# EAGLE design RADIO (EAGLE 9.4.2)
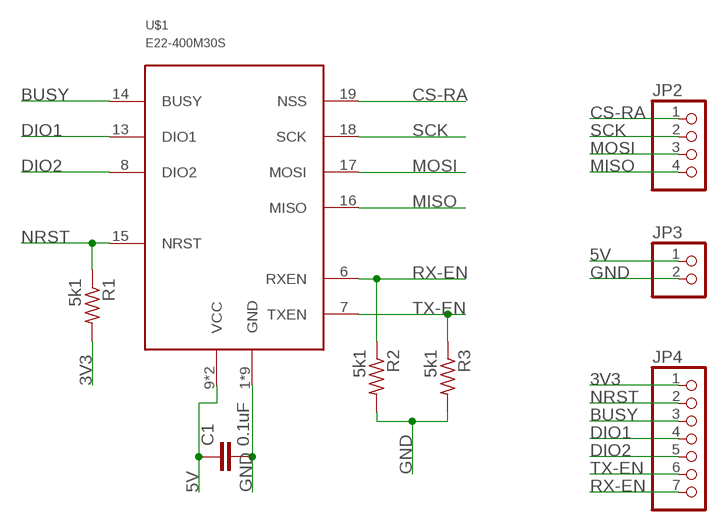
[diagram p0: schematic, sheet 1]

## Parts
C1  0.1uF  C-EUC0603  [C0603]
JP2  PINHD-1X4  [1X04]
JP3  PINHD-1X2  [1X02]
JP4  PINHD-1X7  [1X07]
R1  5k1  R-US_R0603  [R0603]
R2  5k1  R-US_R0603  [R0603]
R3  5k1  R-US_R0603  [R0603]
U$1  E22-400M30S  [E22-400M30S]

## Nets
3V3: JP4.1 R1.2
5V: C1.1 JP3.1 U$1.9(VCC) U$1.10(VCC)
BUSY: JP4.3 U$1.14(BUSY)
CS-RA: JP2.1 U$1.19(NSS)
DIO1: JP4.4 U$1.13(DIO1)
DIO2: JP4.5 U$1.8(DIO2)
GND: C1.2 JP3.2 R2.2 R3.2 U$1.1(GND) U$1.2(GND) U$1.3(GND) U$1.4(GND) U$1.5(GND) U$1.11(GND) U$1.12(GND) U$1.20(GND) U$1.22(GND)
MISO: JP2.4 U$1.16(MISO)
MOSI: JP2.3 U$1.17(MOSI)
NRST: JP4.2 R1.1 U$1.15(NRST)
RX-EN: JP4.7 R2.1 U$1.6(RXEN)
SCK: JP2.2 U$1.18(SCK)
TX-EN: JP4.6 R3.1 U$1.7(TXEN)

## Library data of the parts
C1 = rcl:C-EU: CAPACITOR, European symbol; SPICEPREFIX: C
JP2 = pinhead:PINHD-1X4: PIN HEADER
JP3 = pinhead:PINHD-1X2: PIN HEADER
JP4 = pinhead:PINHD-1X7: PIN HEADER
R1-R3 = resistor:R-US_: RESISTOR, American symbol
U$1 = CanCubeSat:E22-400M30S: EBYTE E22400M30S radio module Datasheet and info: http://www.ebyte.com/en/product-view-news.aspx?id=454

## Board
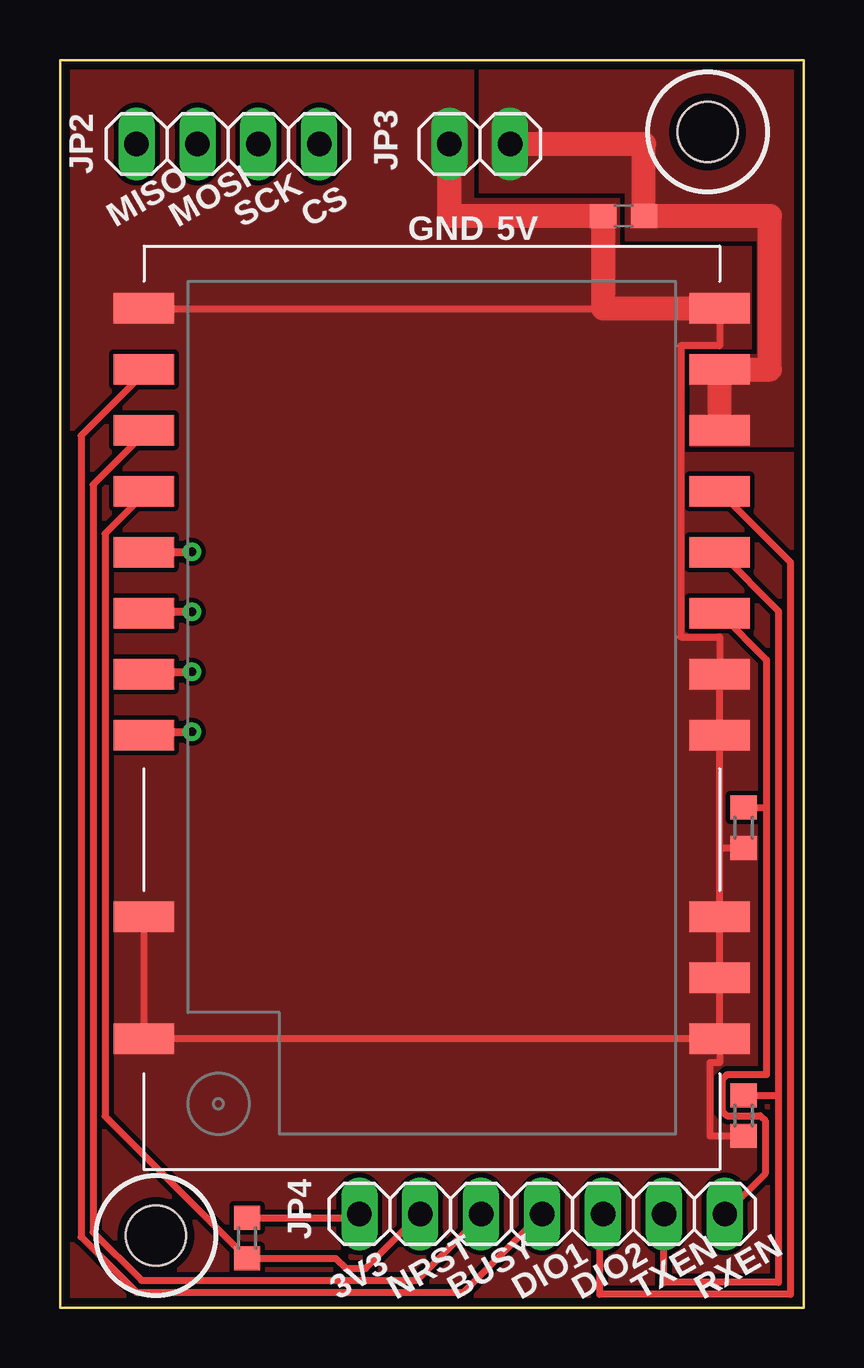
[diagram p1: board, top side]
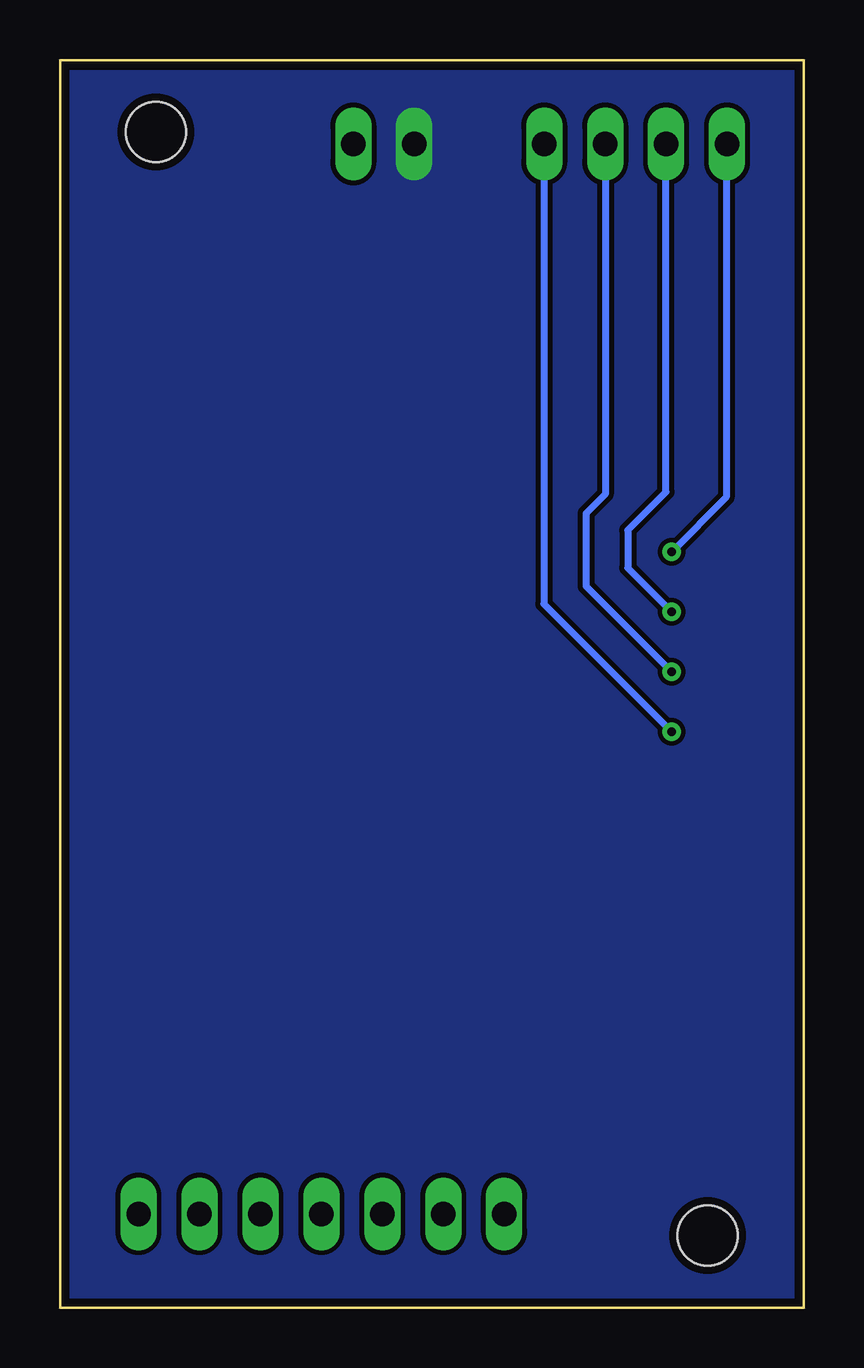
[diagram p2: board, bottom side, seen from below]

Size 31 x 52 mm. Coordinates in mm from the lower left corner, seen from the top.
Outline: 31,0 0,0 0,52 31,52 31,0
Copper layers (1*16): Top 0.035mm / dielectric 1.5mm / Bottom 0.035mm
Design rules "default *": minimum track width 0.3mm, minimum drill 0.35mm, track to track 0.2mm, track to pad 0.2mm, pad to pad 0.2mm, via to via 0.2mm, smd to smd 0.2mm, copper to edge 0.35mm, drill to drill 0.2mm, minimum pad ring 10mil, minimum via ring 8mil, stop-mask expansion 2mil, vias tented up to drill 0mil, thermal gap 10mil
Holes 2.5 mm at 4,3 27,49

### Footprints (pad centres in the part's own frame; a part is rotated, then mirrored left to right if it is on the bottom)
C0603 = smd 1.1 x 1: 1 -0.85,0; 2 0.85,0
1X04 = drill 1.016 long: 1 -3.81,0; 2 -1.27,0; 3 1.27,0; 4 3.81,0
1X02 = drill 1.016 long: 1 -1.27,0; 2 1.27,0
1X07 = drill 1.016 long: 1 -7.62,0; 2 -5.08,0; 3 -2.54,0; 4 0,0; 5 2.54,0; 6 5.08,0; 7 7.62,0
R0603 = smd 1 x 1.1: 1 -0.85,0; 2 0.85,0
E22-400M30S = smd 2.54 x 1.27: 1 12,-13.79; 2 12,-11.25; 3 12,-8.71; 4 12,-1.14; 5 12,1.4; 6 12,3.94; 7 12,6.48; 8 12,9.02; 9 12,11.56; 10 12,14.1; 11 12,16.64; 12 -12,16.64; 13 -12,14.1; 14 -12,11.56; 15 -12,9.02; 16 -12,6.48; 17 -12,3.94; 18 -12,1.4; 19 -12,-1.14; 20 -12,-8.71; 22 -12,-13.79

### Placement (x,y rotation side)
C1  23.5,45.5 180 top
JP2  7,48.5 180 top
JP3  17.5,48.5 180 top
JP4  20.1,3.9 0 top
R1  7.8,2.9 90 top
R2  28.5,20 270 top
R3  28.5,8 270 top
U$1  15.5,25 0 top

### Tracks (layer width: path | path; a pad name or v marks a point on that pad's centre or on a via)
3V3
  Top 0.3: R1.2 12.33,3.75 JP4.1
5V
  Top 1: U$1.9 U$1.10 29.6,39.1 29.6,45.5 C1.1 24.35,48.5 JP3.1
  pour Top (no thermals): 17.5,52 31,52 31,35.9 26.3,35.9 26.3,39.7 29.1,39.7 29.1,44.5 23.6,44.5 23.6,46.5 17.5,46.5
BUSY
  Top 0.3: U$1.14 3.5,36.42 1.38,34.3 1.38,3.15 3.4,1.13 14.88,1.13 17.56,3.81 JP4.3
CS-RA  (via drill 0.35)
  Top 0.34: U$1.19 3.64,24 v5.5,24
  Bottom 0.3: v5.5,24 10.83,29.33 10.83,48.48 JP2.1
DIO1
  Top 0.3: U$1.13 3.5,38.96 0.88,36.34 0.88,2.94 3.19,0.63 16.83,0.63 JP4.4
DIO2
  Top 0.3: U$1.8 30.45,31.07 30.45,0.55 22.5,0.55 22.5,3.76 JP4.5
GND
  Top 0.3: 27.5,11.5 U$1.1 27.5,10.2 27.1,10.2 27.1,7.15 R3.2 | 27.5,11.5 U$1.2 U$1.3 27.5,19.15 | 27.5,19.15 R2.2 | 27.5,19.15 U$1.4 U$1.5 27.5,27.95 25.88,27.95 25.88,40.09 27.5,40.09 U$1.11 U$1.12 | U$1.20 U$1.22 27.21,11.21 27.5,11.5
  Top 1: JP3.2 16.23,45.5 C1.2 22.65,41.64 U$1.11
  pour Top (rank 2, no thermals): 0,0 0,52 31,52 31,0
  pour Bottom (no thermals): 0,0 0,52 31,52 31,0
MISO  (via drill 0.35)
  Top 0.34: U$1.16 3.52,31.5 v5.5,31.5
  Bottom 0.3: JP2.4 3.23,48.46 3.23,33.77 v5.5,31.5
MOSI  (via drill 0.35)
  Top 0.34: v5.5,29 3.56,29 U$1.17
  Bottom 0.3: v5.5,29 7.33,30.83 7.33,32.4 5.73,34 JP2.3
NRST
  Top 0.3: U$1.15 3.5,33.88 1.88,32.26 1.88,7.97 R1.1 11.49,2.05 11.92,1.63 12.75,1.63 JP4.2
RX-EN
  Top 0.3: U$1.6 29.45,26.99 29.45,20.85 | 29.45,20.85 29.45,9.7 27.8,9.7 27.6,9.49 27.6,8.21 27.8,8 29.2,8 29.4,7.79 29.4,5.58 JP4.7 | R2.1 29.45,20.85
SCK  (via drill 0.35)
  Top 0.34: U$1.18 3.6,26.5 v5.5,26.5
  Bottom 0.3: JP2.2 8.27,33.9 9.07,33.1 9.07,30.07 v5.5,26.5
TX-EN
  Top 0.3: JP4.6 25.18,1.05 29.95,1.05 29.95,8.85 | U$1.7 29.95,29.03 29.95,8.85 | R3.1 29.95,8.85

### Text on the board
tPlace: MISO | MOSI | SCK | CS | GND | 5V | 3V3 | NRST | BUSY | DIO1 | DIO2 | TXEN | RXEN